# EAGLE design ATmegaProgramming (EAGLE 6.2)
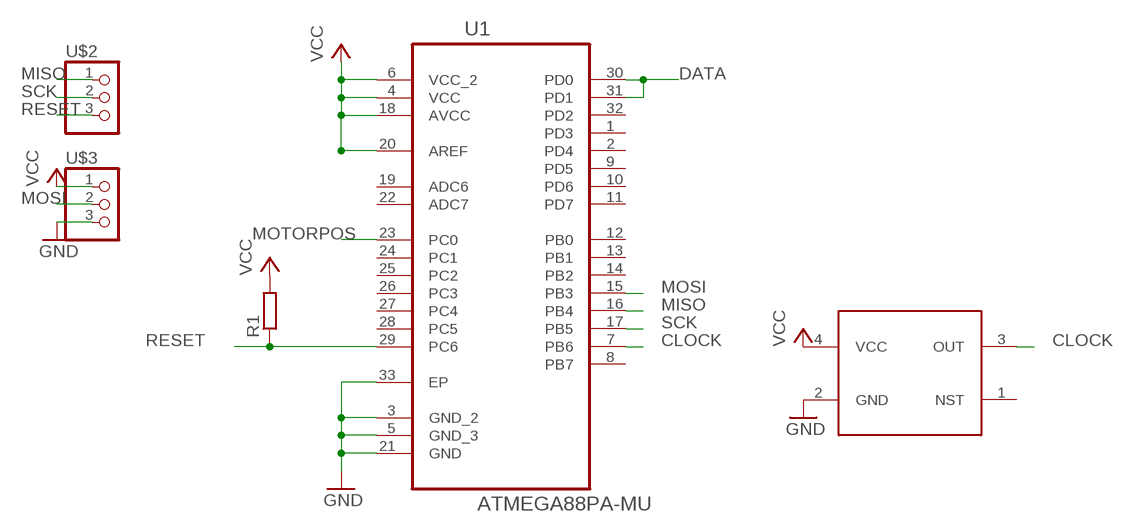
[diagram p0: schematic, sheet 1]

## Parts
R1  R-EU_0414/15  [0414/15]
U1  ATMEGA88PA-MU  [QFN50P500X500X100-33N]
U$1  SG-310  [SG-310]
U$2  CONNEC_1X03  [CONNEC_1X03]
U$3  CONNEC_1X03  [CONNEC_1X03]

## Nets
CLOCK: U1.7(PB6) U$1.3(OUT)
DATA: U1.30(PD0) U1.31(PD1)
GND: U1.3(GND_2) U1.5(GND_3) U1.21(GND) U1.33(EP) U$1.2(GND) U$3.3
MISO: U1.16(PB4) U$2.1
MOSI: U1.15(PB3) U$3.2
MOTORPOS: U1.23(PC0)
RESET: R1.1 U1.29(PC6) U$2.3
SCK: U1.17(PB5) U$2.2
VCC: R1.2 U1.4(VCC) U1.6(VCC_2) U1.18(AVCC) U1.20(AREF) U$1.4(VCC) U$3.1
Unconnected: U1.1(PD3) U1.2(PD4) U1.8(PB7) U1.9(PD5) U1.10(PD6) U1.11(PD7) U1.12(PB0) U1.13(PB1) U1.14(PB2) U1.19(ADC6) U1.22(ADC7) U1.24(PC1) U1.25(PC2) U1.26(PC3) U1.27(PC4) U1.28(PC5) U1.32(PD2) U$1.1(NST)

## Library data of the parts
R1 = resistor:R-EU_: RESISTOR, European symbol
U1 = RobotCampus:ATMEGA88PA-MU: Programmable Flash; MPN: ATMEGA88PA-MU; OC_FARNELL: 1715491; OC_NEWARK: 15R0272; PACKAGE: QFN-32; SUPPLIER: Atmel
U$1 = RobotCampus:SG-310
U$2 U$3 = RobotCampus:CONNEC_1X03

## Board
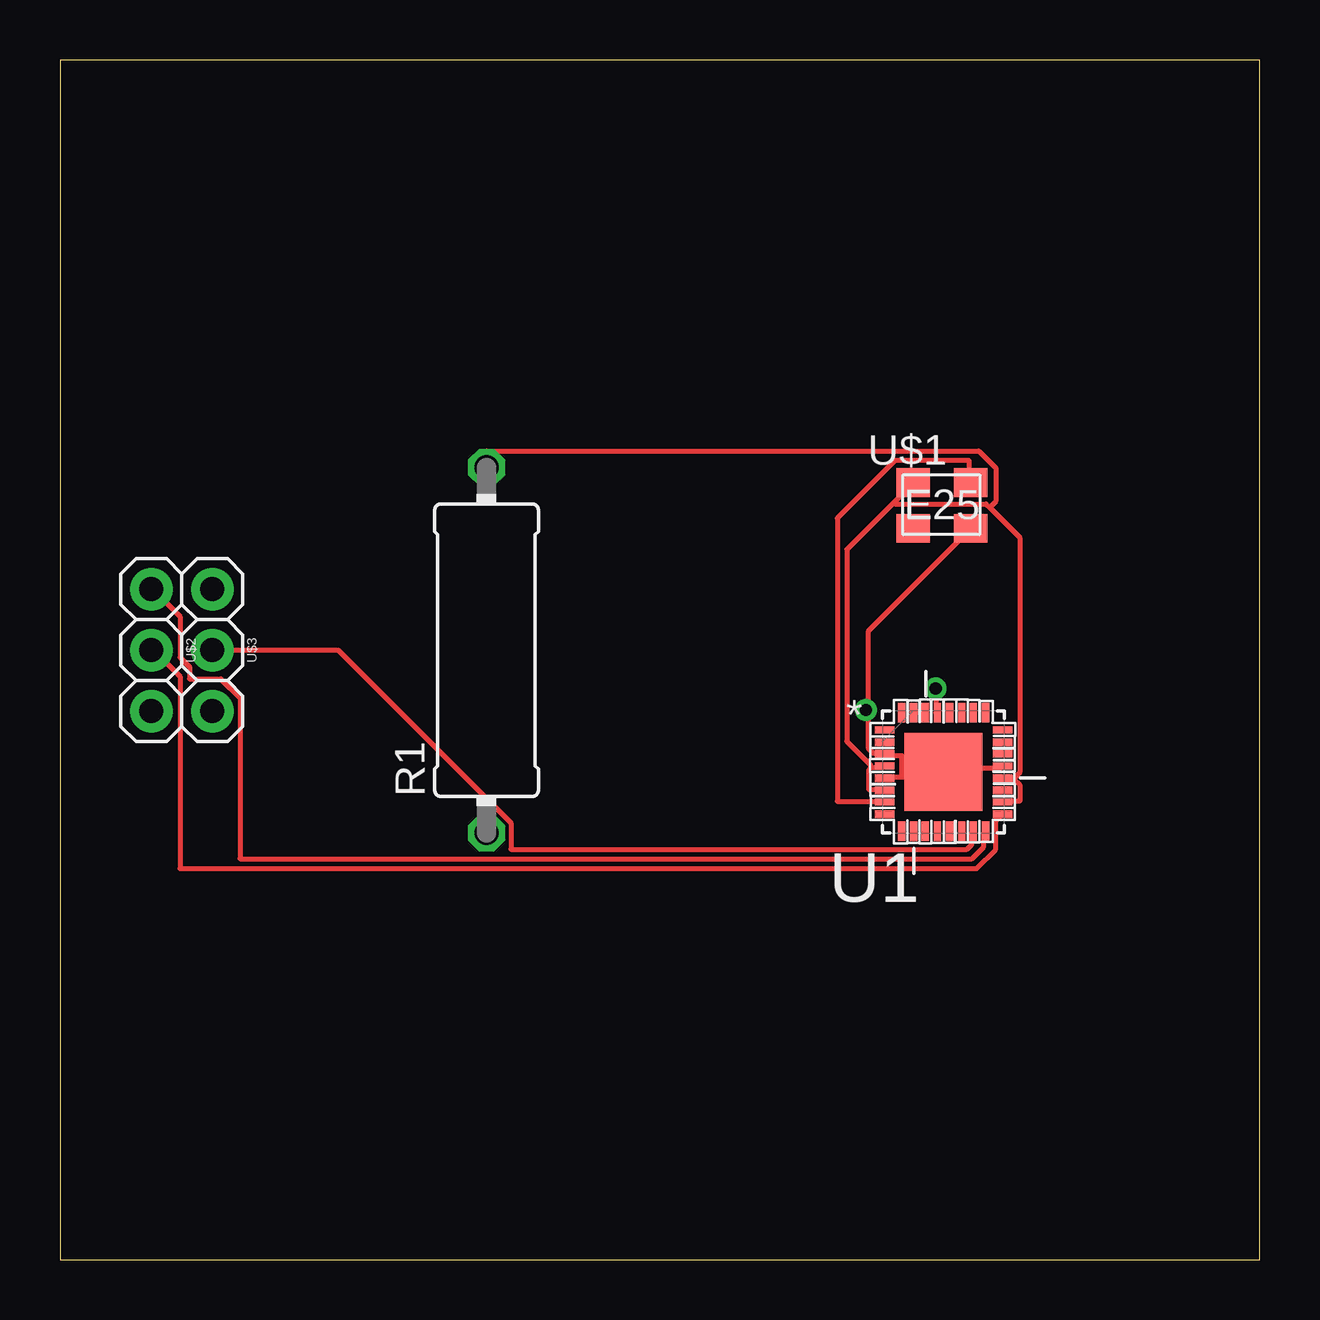
[diagram p1: board, top side]
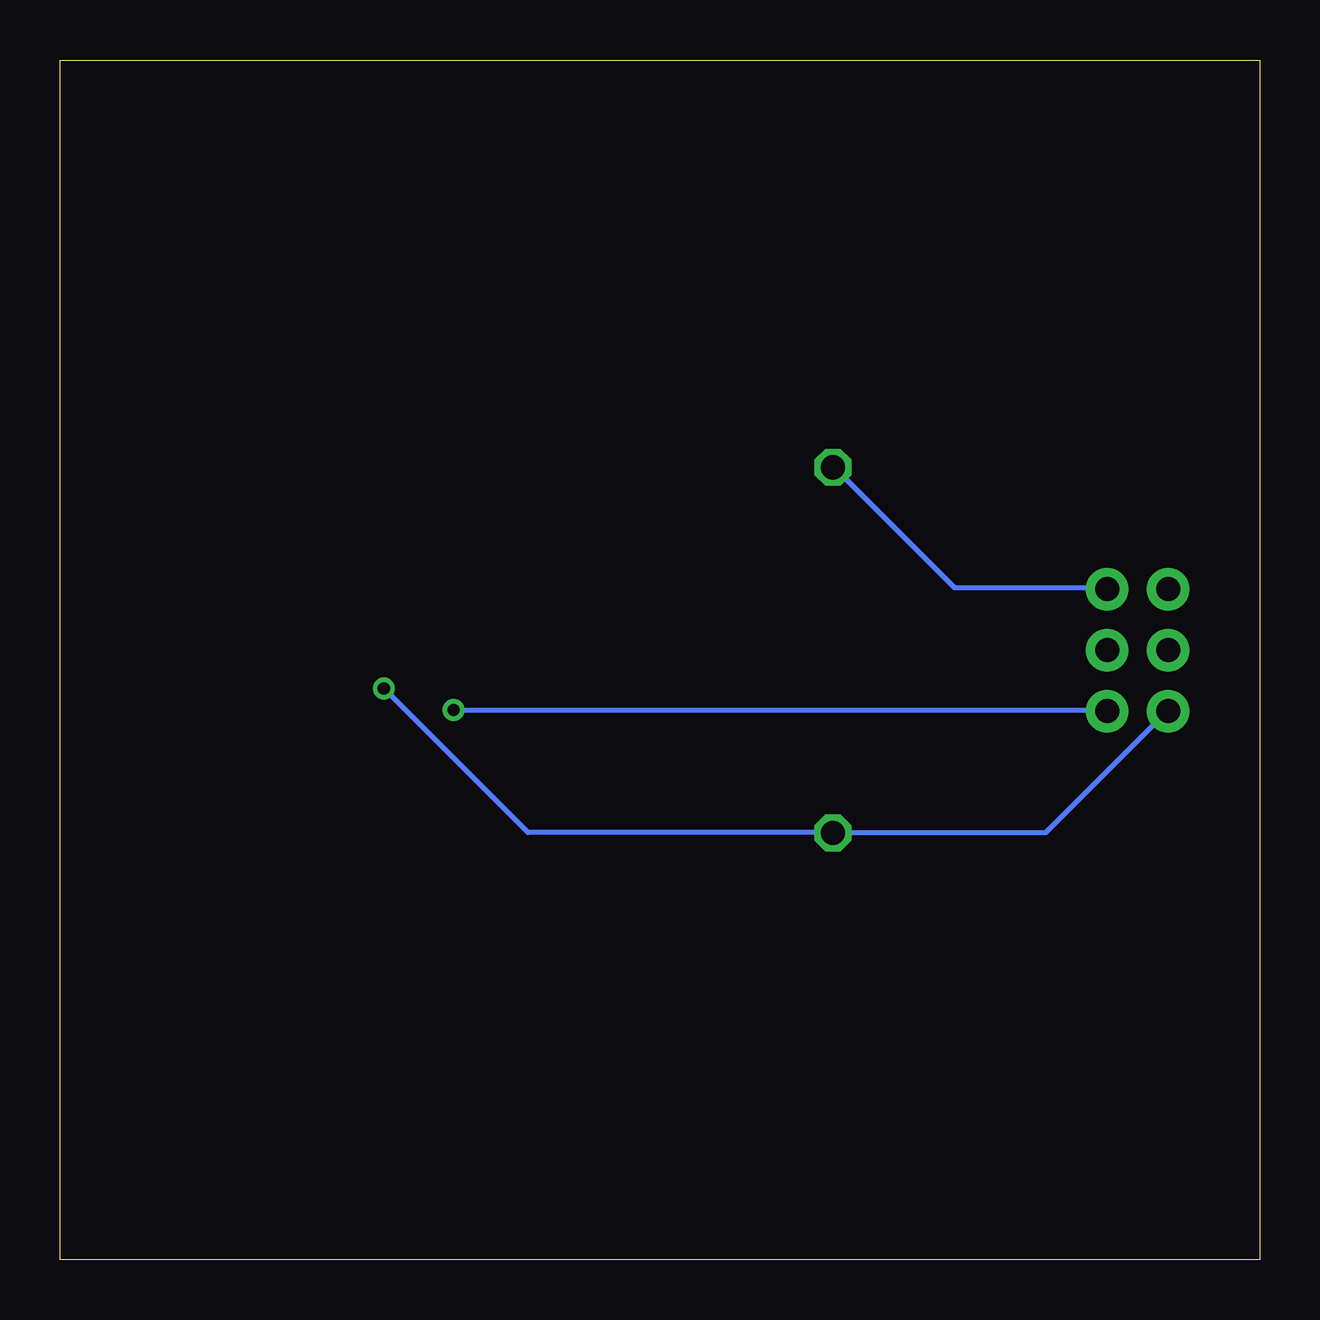
[diagram p2: board, bottom side, seen from below]

Size 50 x 50 mm. Coordinates in mm from the lower left corner, seen from the top.
Outline: 0,0 50,0 50,50 0,50 0,0
Copper layers (1*16): Top 0.035mm / dielectric 1.5mm / Bottom 0.035mm
Design rules: minimum track width 8mil, minimum drill 20mil, track to track 6mil, track to pad 6mil, pad to pad 6mil, via to via 6mil, smd to smd 6mil, copper to edge 20mil, drill to drill 5mil, minimum pad ring 10mil, minimum via ring 8mil, stop-mask expansion 4mil, vias tented up to drill 0mil, thermal gap 10mil

### Footprints (pad centres in the part's own frame; a part is rotated, then mirrored left to right if it is on the bottom)
0414/15 = drill 1.016 octagon: 1 -7.62,0; 2 7.62,0
QFN50P500X500X100-33N = smd 0.813 x 0.305: 1 -2.464,1.753; 2 -2.464,1.245; 3 -2.464,0.762; 4 -2.464,0.254; 5 -2.464,-0.254; 6 -2.464,-0.762; 7 -2.464,-1.245; 8 -2.464,-1.753; 17 2.464,-1.753; 18 2.464,-1.245; 19 2.464,-0.762; 20 2.464,-0.254; 21 2.464,0.254; 22 2.464,0.762; 23 2.464,1.245; 24 2.464,1.753 | smd 0.305 x 0.813: 9 -1.753,-2.464; 10 -1.245,-2.464; 11 -0.762,-2.464; 12 -0.254,-2.464; 13 0.254,-2.464; 14 0.762,-2.464; 15 1.245,-2.464; 16 1.753,-2.464; 25 1.753,2.464; 26 1.245,2.464; 27 0.762,2.464; 28 0.254,2.464; 29 -0.254,2.464; 30 -0.762,2.464; 31 -1.245,2.464; 32 -1.753,2.464 | smd 3.251 x 3.251: 33 0,0
SG-310 = smd 1.4 x 1.2: 1 0,0; 2 2.4,0; 3 2.4,1.9; 4 0,1.9
CONNEC_1X03 = drill 1 pad 1.778: 1 -1.27,1.27; 2 1.27,1.27; 3 3.81,1.27

### Placement (x,y rotation side)
R1  17.78,25.4 90 top
U1  36.83,20.32 0 top
U$1  35.56,30.48 0 top
U$2  2.54,26.67 270 top
U$3  5.08,26.67 270 top

### Tracks (layer width: path | path; a pad name or v marks a point on that pad's centre or on a via)
CLOCK
  Top 0.203: U1.7 34.3,19.1 32.4,19.1 32.4,30.9 34.8,33.3 37.9,33.3 37.9,32.4 U$1.3
DATA
  Top 0.203: U1.31 35.6,22.8 36,22.8 U1.30
GND  (via drill 0.51)
  Top 0.203: 35.1,20.1 36.8,20.1 36.8,20.3 U1.33 36.9,20.4 36.9,20.5 39.2,20.5 U1.21 | 35.1,20.1 34.4,20.1 U1.5 | 35.1,20.1 35.1,21 34.4,21 U1.3 34.3,21.1 33.9,21.1 33.7,21.3 33.7,22.9 | 33.7,22.9 33.7,26.2 37.9,30.4 U$1.2 | v33.6,22.9 33.7,22.9
  Bottom 0.203: v33.6,22.9 6.4,22.9 U$3.3
MISO
  Top 0.203: U1.16 38.5,17.8 38.5,17.2 38,16.7 7.5,16.7 7.5,23.4 6.7,24.2 5.4,24.2 5.4,24.7 5,25.1 5,26.8 3.9,27.9 U$2.1
MOSI
  Top 0.203: U$3.2 11.6,25.4 18.8,18.2 18.8,17.1 37.8,17.1 38,17.3 38,17.8 U1.15
RESET  (via drill 0.51)
  Top 0.203: v36.5,23.8 36.5,22.8 U1.29
  Bottom 0.203: v36.5,23.8 30.5,17.8 17.8,17.8 R1.1 17.7,17.8 8.9,17.8 3.9,22.8 U$2.3
SCK
  Top 0.203: U1.17 39.2,18.5 39,18.3 39,17.1 38.2,16.3 5,16.3 5,24.3 3.9,25.4 U$2.2
VCC
  Top 0.203: 39.8,20 40,19.8 40,19.1 39.3,19.1 U1.18 | 39.8,20 39.3,20 U1.20 | 33.8,20.5 33.7,20.4 33.7,19.6 34.3,19.6 U1.6 | 33.8,20.5 34.3,20.5 U1.4 | 34.75,31.55 35.5,32.3 U$1.4 | 34.75,31.55 32.8,29.6 32.8,21.6 33.8,20.6 33.8,20.5 | 38.75,31.35 38.6,31.5 34.8,31.5 34.75,31.55 | 38.75,31.35 40,30.1 40,20.3 39.8,20.1 39.8,20 | 38.75,31.35 39,31.6 39,33 38.3,33.7 17.8,33.7 17.8,33.1 R1.2
  Bottom 0.203: R1.2 17.7,33 12.7,28 6.4,28 U$3.1